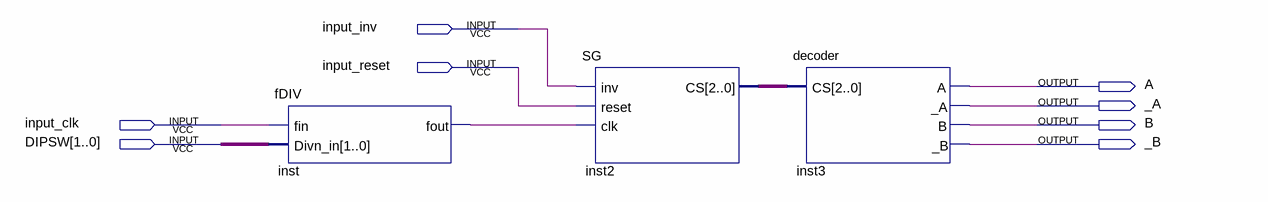
[diagram p0: schematic sheet]
// Quartus schematic MCC.bdf as structural Verilog: 3 symbols, 8 pins
module MCC (
  input  input_inv,
  input  input_reset,
  input  input_clk,
  input  [1:0] DIPSW,
  output A,
  output _A,
  output B,
  output _B
);

  wire inst_fout;
  wire [2:0] inst2_cs;

  fDIV inst (.fin(input_clk), .Divn_in(DIPSW), .fout(inst_fout));
  SG inst2 (.inv(input_inv), .reset(input_reset), .clk(inst_fout), .CS(inst2_cs));
  decoder inst3 (.CS(inst2_cs), .A(A), ._A(_A), .B(B), ._B(_B));
endmodule
